# EasyEDA Pro project ProPrj_4足轮足机器蜘蛛_2024-09-02.epro, board 核心板
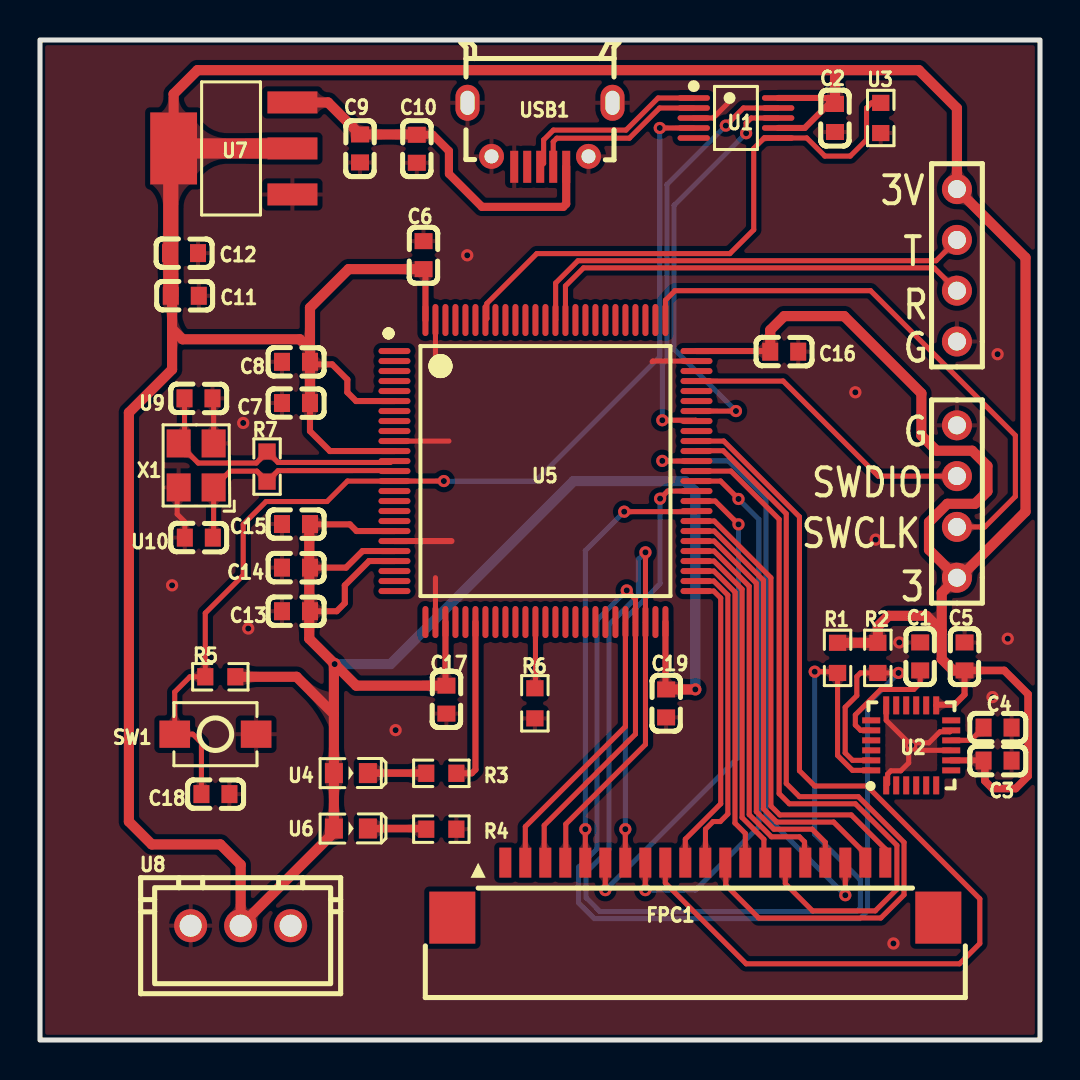
[diagram p4: board, top side]
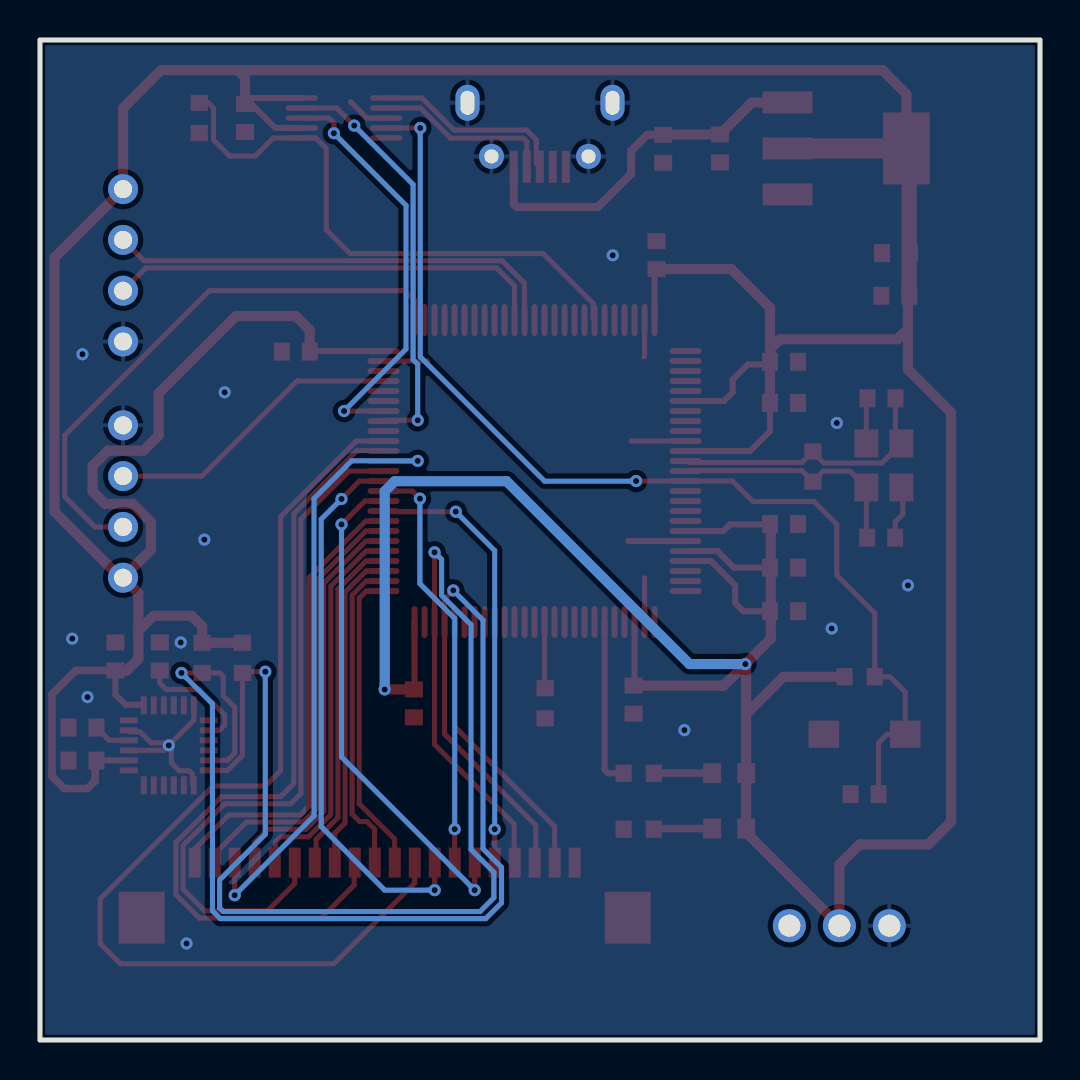
[diagram p5: board, bottom side, seen from below]

Outline 50 x 50 mm; copper layers: Top Layer, Bottom Layer. Coordinates in mm from the lower left corner of the outline.
Outline path: rectangle 0,50 50,0
Stack: Top Layer 0.035mm / Dielectric1 1.51mm FR4 er 4.5 / Bottom Layer 0.035mm

## Design rules (mm)
template: JLCPCB Capability(Two Layers Board)
spacing copperThickness1oz (default): track to track 0.102, other pairs 0.152 to 0.3
spacing copperThickness2oz: track to track 0.203, other pairs 0.152 to 0.3
track width copperThickness1oz (default): min 0.127, default 0.254, max 2.54
track width copperThickness2oz: min 0.203, default 0.254, max 2.54
differential pair differentialPair (default): width min 0.127, default 0.254, max 2.54; gap min 0.152, default 0.152
via viaSize (default): diameter min 0.5, default 0.61, max 10; hole min 0.3, default 0.305, max 6.3

## Placement (name value [footprint] x y rotation side)
C1  2.2nF  [C0603]  44.01 19.18 90 top
C2  100nF  [C0603]  39.75 46.1 90 top
C3  10nF  [C0603]  47.88 13.97 180 top
C4  100nF  [C0603]  47.88 15.62 180 top
C5  100nF  [C0603]  46.23 19.18 90 top
C6  100nF  [C0603]  19.18 39.24 90 top
C7  100nF  [C0603]  12.8 31.85 180 top
C8  100nF  [C0603]  12.8 33.91 180 top
C9  10uF  [C0603]  16 44.58 90 top
C10  100nF  [C0603]  18.84 44.56 270 top
C11  100nF  [C0603]  7.24 37.21 0 top
C12  10uF  [C0603]  7.2 39.34 180 top
C13  100nF  [C0603]  12.8 21.44 180 top
C14  100nF  [C0603]  12.8 23.62 180 top
C15  100nF  [C0603]  12.8 25.8 180 top
C16  100nF  [C0603]  37.21 34.42 0 top
C17  100nF  [C0603]  20.32 17.02 270 top
C18  1uF  [C0603]  8.77 12.3 180 top
C19  100nF  [C0603]  31.31 16.83 270 top
FPC1  1.0K-FX-20PWBG  [FPC-SMD_20P-P1.00-HDGE_1.0K-FX-20PWBG]  32.77 7.49 0 top
R1  10kΩ  [R0603]  39.88 19.11 90 top
R2  10kΩ  [R0603]  41.89 19.11 90 top
R3  1kΩ  [R0603]  20.07 13.33 180 top
R4  1kΩ  [R0603]  20.07 10.54 180 top
R5  10kΩ  [R0603]  9.02 18.16 180 top
R6  10kΩ  [R0603]  24.74 16.83 90 top
R7  1MΩ  [R0603]  11.35 28.67 90 top
SW1  TD-1185SA-2.5H-250  [SW-SMD_L4.0-W2.9-LS5.0]  8.77 15.29 0 top
U1  CH340X  [MSOP-10_L3.0-W3.0-P0.50-LS5.0-BL]  34.8 46.1 270 top
U2  MPU6050_C9900042518  [QFN-24_L4.0-W4.0-P0.50-BL]  43.56 14.73 0 top
U3  4.7kΩ  [R0603]  42.04 46.1 270 top
U4  LED0603B_C9900017731  [LED0603_BLUE]  15.54 13.35 0 top
U5  GD32F470VIT6  [LQFP-100_L14.0-W14.0-P0.50-LS16.0-BL]  25.27 28.45 270 top
U6  LED0603B_C9900017731  [LED0603_BLUE]  15.54 10.57 0 top
U7  AMS1117-3.3  [SOT-223-3_L6.5-W3.4-P2.30-LS7.0-BR]  9.65 44.58 0 top
U8  XH2.54-3P 直插  [CONN-TH_XH2.54-3P]  10.03 5.72 0 top
U9  22pF  [C0603]  7.93 32.08 180 top
U10  22pF  [C0603]  7.94 25.12 0 top
U33  XH2.54MM-4PIN直插式  [XH2.54MM-4PIN]  45.85 42.55 270 top
U34  XH2.54MM-4PIN直插式  [XH2.54MM-4PIN]  45.85 23.11 90 top
USB1  USB-MICRO XNJ JB  [MICRO-USB-SMD_HX-USB-MICRO-XNJ-JB]  25 45.26 180 top
X1  25MHz  [OSC-SMD_4P-L3.2-W2.5-BL]  7.81 28.73 90 top

## Footprints (pads in the part's own frame, mm; a bottom-side part is the same pattern mirrored in y, then rotated)
C0603
  rect 0.8x0.9 smd: 1(-0.7,0) 2(0.7,0)
CONN-TH_XH2.54-3P
  round 1.65 hole 1.1: 1(-2.5,0) 2(0,0) 3(2.5,0)
FPC-SMD_20P-P1.00-HDGE_1.0K-FX-20PWBG
  rect 0.6x1.5 smd: 1(-9.5,1.375) 2(-8.5,1.375) 3(-7.5,1.375) 4(-6.5,1.375) 5(-5.5,1.375) 6(-4.5,1.375) 7(-3.5,1.375) 8(-2.5,1.375) 9(-1.5,1.375) 10(-0.5,1.375) 11(0.5,1.375) 12(1.5,1.375) 13(2.5,1.375) 14(3.5,1.375) 15(4.5,1.375) 16(5.5,1.375) 17(6.5,1.375) 18(7.5,1.375) 19(8.5,1.375) 20(9.5,1.375)
  rect 2.3x2.6 smd: 21(12.15,-1.375) 22(-12.15,-1.375)
LED0603_BLUE
  rect 0.9x1 smd: 1(-0.85,0) 2(0.85,0)
LQFP-100_L14.0-W14.0-P0.50-LS16.0-BL
  oval 0.3x1.6 smd: 1(-6,-7.55) 2(-5.5,-7.55) 3(-5,-7.55) 4(-4.5,-7.55) 5(-4,-7.55) 6(-3.5,-7.55) 7(-3,-7.55) 8(-2.5,-7.55) 9(-2,-7.55) 10(-1.5,-7.55) 11(-1,-7.55) 12(-0.5,-7.55) 13(0,-7.55) 14(0.5,-7.55) 15(1,-7.55) 16(1.5,-7.55) 17(2,-7.55) 18(2.5,-7.55) 19(3,-7.55) 20(3.5,-7.55) 21(4,-7.55) 22(4.5,-7.55) 23(5,-7.55) 24(5.5,-7.55) 25(6,-7.55) 51(6,7.55) 52(5.5,7.55) 53(5,7.55) 54(4.5,7.55) 55(4,7.55) 56(3.5,7.55) 57(3,7.55) 58(2.5,7.55) 59(2,7.55) 60(1.5,7.55) 61(1,7.55) 62(0.5,7.55) 63(0,7.55) 64(-0.5,7.55) 65(-1,7.55) 66(-1.5,7.55) 67(-2,7.55) 68(-2.5,7.55) 69(-3,7.55) 70(-3.5,7.55) 71(-4,7.55) 72(-4.5,7.55) 73(-5,7.55) 74(-5.5,7.55) 75(-6,7.55)
  oval 1.6x0.3 smd: 26(7.55,-6) 27(7.55,-5.5) 28(7.55,-5) 29(7.55,-4.5) 30(7.55,-4) 31(7.55,-3.5) 32(7.55,-3) 33(7.55,-2.5) 34(7.55,-2) 35(7.55,-1.5) 36(7.55,-1) 37(7.55,-0.5) 38(7.55,0) 39(7.55,0.5) 40(7.55,1) 41(7.55,1.5) 42(7.55,2) 43(7.55,2.5) 44(7.55,3) 45(7.55,3.5) 46(7.55,4) 47(7.55,4.5) 48(7.55,5) 49(7.55,5.5) 50(7.55,6) 76(-7.55,6) 77(-7.55,5.5) 78(-7.55,5) 79(-7.55,4.5) 80(-7.55,4) 81(-7.55,3.5) 82(-7.55,3) 83(-7.55,2.5) 84(-7.55,2) 85(-7.55,1.5) 86(-7.55,1) 87(-7.55,0.5) 88(-7.55,0) 89(-7.55,-0.5) 90(-7.55,-1) 91(-7.55,-1.5) 92(-7.55,-2) 93(-7.55,-2.5) 94(-7.55,-3) 95(-7.55,-3.5) 96(-7.55,-4) 97(-7.55,-4.5) 98(-7.55,-5) 99(-7.55,-5.5) 100(-7.55,-6)
MICRO-USB-SMD_HX-USB-MICRO-XNJ-JB
  rect 0.4x1.6 smd: 1(-1.31,1.6) 2(-0.66,1.6) 3(-0.011,1.6) 4(0.639,1.6) 5(1.29,1.6)
  round 1.25 hole 0.7: 6(-2.425,1.08) 7(2.425,1.08)
  oval 1.2x1.8 hole 0.7x1.2: 8(3.625,-1.6) 9(-3.625,-1.6)
MSOP-10_L3.0-W3.0-P0.50-LS5.0-BL
  oval 0.28x1.62 smd: 1(-1,-2.11) 2(-0.5,-2.11) 3(0,-2.11) 4(0.5,-2.11) 5(1,-2.11) 6(1,2.11) 7(0.5,2.11) 8(0,2.11) 9(-0.5,2.11) 10(-1,2.11)
OSC-SMD_4P-L3.2-W2.5-BL
  rect 1.4x1.2 smd: 1(-1.1,-0.875) 2(1.1,-0.875) 3(1.1,0.875) 4(-1.1,0.875)
QFN-24_L4.0-W4.0-P0.50-BL
  rect 0.3x0.9 smd: 1(-1.25,-2) 2(-0.75,-2) 3(-0.25,-2) 4(0.25,-2) 5(0.75,-2) 6(1.25,-2) 13(1.25,2) 14(0.75,2) 15(0.25,2) 16(-0.25,2) 17(-0.75,2) 18(-1.25,2)
  rect 0.9x0.3 smd: 7(2,-1.25) 8(2,-0.75) 9(2,-0.25) 10(2,0.25) 11(2,0.75) 12(2,1.25) 19(-2,1.25) 20(-2,0.75) 21(-2,0.25) 22(-2,-0.25) 23(-2,-0.75) 24(-2,-1.25)
R0603
  rect 0.806x0.864 smd: 1(-0.753,0) 2(0.753,0)
SOT-223-3_L6.5-W3.4-P2.30-LS7.0-BR
  rect 2.5x1.1 smd: 1(2.97,-2.3) 2(2.97,0) 3(2.97,2.3)
  rect 2.34x3.6 smd: 4(-2.97,0)
SW-SMD_L4.0-W2.9-LS5.0
  rect 1.53x1.36 smd: 1(-2.035,0) 2(2.035,0)
XH2.54MM-4PIN
  round 1.5 hole 0.9: 1(0,0) 2(2.54,0) 3(5.08,0) 4(7.62,0)

## Nets
As in the schematic.

Pads without a net: FPC1 1 21 22; U1 5; U2 2 3 4 5 6 7 12 14 15 16 17 19 21 22; U5 1 2 3 4 5 7 8 9 15 16 17 18 23 24 25 26 29 30 32 33 34 35 36 38 39 40 41 42 43 44 45 49 67 70 71 73 77 78 79 80 81 82 83 84 85 88 89 90 91 92 93 95 96 97 98; USB1 4

## Via types
v1: diameter 0.61, hole 0.305, Top Layer to Bottom Layer, 35 vias

## Routing (per net, layer and track width the routed paths; a pad name or vN(x,y) marks a point on that pad's centre or on a via; arc(x,y) is an arc through that point)
3.3V: length 306.1
  Top Layer w0.305: U2.8 47.17,13.98 C3.2 ; U5.100 19.27,38.45 19.18,38.54 ; U5.50 31.27,17.56 C19.1 ; 17.72,25.45 15.83,25.45 15.49,25.78 13.52,25.78 C15.1 ; C16.1 36.48,34.45 U5.75 ; C8.1 13.63,33.78 14.6,33.78 15.37,33.02 15.37,32.39 15.8,31.95 17.72,31.95 ; U2.13 44.84,16.76 45.72,16.76 46.23,17.27 C5.1 ; C14.1 15.3,23.62 16.13,24.45 17.72,24.45 ; 17.72,29.45 14.49,29.45 13.5,30.44 C7.1 ; C17.1 20.27,17.77 U5.28 ; U1.7 38.24,45.6 39.44,46.8 C2.2 39.45,47.1 U1.10 ; C13.1 14.84,21.44 15.24,21.84 15.24,22.73 16.46,23.95 17.72,23.95
  Top Layer w0.381: C5.1 48.21,18.48 49.4,17.29 49.4,13.19 48.78,12.57 47.62,12.57 47.24,12.95 47.24,13.91 C3.2
  Top Layer w0.508: U34.1 45.09,22.35 45.09,20.45 ; U34.1 45.97,23.11 49.28,26.42 49.28,39.12 U33.1 45.85,46.59 43.94,48.49 40.11,48.49 ; U34.1 44.45,24.51 44.45,25.89 45.37,26.81 46.75,26.81 47.37,27.43 47.37,28.7 46.61,29.46 44.83,29.46 44.07,30.23 44.07,32.33 40.21,36.19 37.21,36.19 36.51,35.5 C16.1 ; 40.11,48.49 39.75,48.13 C2.2 ; 40.11,48.49 7.87,48.49 6.68,47.3 U7.4 ; C15.1 13.46,25.76 13.46,20.07 14.69,18.83 ; 45.09,20.45 44.32,21.21 42.42,21.21 41.89,20.68 R2.2 R1.2 ; 45.09,20.45 45.09,19.05 45.66,18.48 C5.1 ; C17.1 15.81,17.72 14.69,18.83 ; C7.1 C8.1 13.5,34.53 ; 6.6,35.56 6.6,37.15 C11.1 ; 6.6,35.56 7.13,35.04 12.99,35.04 13.5,34.53 ; 6.6,35.56 6.6,33.53 4.44,31.37 4.44,10.92 5.59,9.78 9.02,9.78 10.03,8.76 U8.2 14.69,10.38 U6.1 U4.1 14.69,16.29 ; 13.5,34.53 13.5,36.61 15.43,38.54 19.18,38.54 ; 14.69,18.83 14.69,16.29 ; C19.1 v1(32.77,17.53) ; R5.1 12.83,18.16 14.69,16.29
  Top Layer w0.762: U7.4 6.54,44.43 C11.1
  Top Layer w1.016: U7.2 U7.4
  Bottom Layer w0.508: v1(32.77,17.53) 32.77,27.43 32.26,27.94 26.67,27.94 17.53,18.8 v1(14.73,18.8)
GND: length 28.6
  Top Layer w0.254: 34.48,46.93 33.66,46.1 U1.3 ; 19.81,34.16 19.77,34.2 U5.99 ; U2.1 42.38,12.8 42.38,13.3 42.55,13.46 43.04,13.46 43.43,13.86 43.43,14.86 ; 43.43,14.86 44.44,14.86 45,15.41 45.49,15.41 U2.11 ; 43.43,14.86 42.31,15.98 U2.18 ; U2.9 43.81,14.48 v1(43.56,14.73) ; U5.27 19.77,23.11 ; 30.61,33.91 30.65,33.95 U5.74 ; U10.1 7.24,25.91 6.86,26.29 6.86,27.55 X1.4 ; 17.72,29.95 20.45,29.95 ; X1.2 8.68,32.03
  Top Layer w0.305: 17.72,24.95 20.57,24.95
  vias: v1(6.6,22.73) v1(10.16,30.85) v1(10.41,20.57) v1(17.78,15.49) v1(21.36,39.24) v1(40.77,32.39) v1(41.78,25.02) v1(42.67,4.83) v1(42.96,19.88) v1(47.62,17.14) v1(47.88,34.29) v1(48.39,20.07)
VBUS: length 18.4
  Top Layer w0.406: C10.1 19.64,45.26 20.45,44.45 20.45,43.31 22.1,41.66 26.16,41.66 26.31,41.8 USB1.1
  Top Layer w0.508: C10.1 18.82,45.28 C9.2 14.4,46.88 U7.3
BOOT0: length 28.8
  Top Layer w0.254: U3.1 41.58,46.85 41.33,46.6 41.33,45.01 40.51,44.2 39.24,44.2 38.34,45.1 U1.6 36.21,45.1 35.69,44.58 35.69,40.51 34.49,39.32 24.84,39.32 22.34,36.83 22.34,36.07 U5.94
BOOT1: length 3.3
  Top Layer w0.254: U5.37 24.77,17.62 R6.2
D+: length 9.8
  Top Layer w0.254: USB1.3 25.18,43.83 25.18,45.01 25.67,45.5 29.3,45.5 30.91,47.1 U1.1
D-: length 9
  Top Layer w0.254: USB1.2 25.66,44.91 25.84,45.09 29.47,45.09 30.98,46.6 U1.2
I2C1_SCL: length 67.5
  Top Layer w0.254: v1(29.34,22.48) 29.77,22.04 U5.47 29.77,15.3 25.21,10.73 25.21,8.92 FPC1.3 ; v1(42.93,18.35) R2.1 41.02,18.35 40.84,18.17 40.84,17.22 40.26,16.64 40.26,14.35 40.63,13.98 U2.23
  Bottom Layer w0.254: v1(42.93,18.35) 41.38,16.8 41.38,6.46 40.99,6.07 27.71,6.07 26.92,6.86 26.92,8.64 27.85,9.56 27.85,20.99 v1(29.34,22.48)
I2C1_SDA: length 69.8
  Top Layer w0.254: v1(30.27,24.38) U5.48 30.27,14.78 26.29,10.8 26.29,8.89 FPC1.4 ; v1(38.74,18.42) 39.82,18.42 R1.1 39.88,14.23 40.62,13.48 U2.24
  Bottom Layer w0.254: v1(38.74,18.42) 38.74,10.29 41.02,8 41.02,6.6 40.84,6.42 27.99,6.42 27.31,7.11 27.31,8.38 28.45,9.53 28.45,20.76 29.92,22.24 29.92,24.03 v1(30.27,24.38)
LEFT1_AIN1: length 20.4
  Top Layer w0.254: FPC1.17 39.27,9.88 38.61,10.54 36.69,10.54 35.82,11.42 35.82,22.84 33.7,24.95 U5.56
LEFT1_AIN2: length 19.2
  Top Layer w0.254: U5.55 33.7,24.45 35.46,22.69 35.46,11.27 36.57,10.16 37.97,10.16 38.23,9.91 38.23,8.91 FPC1.16
LEFT1_IN: length 27.6
  Top Layer w0.254: U5.62 34.03,27.95 v1(34.93,27.05) ; FPC1.8 v1(30.27,7.49)
  Bottom Layer w0.254: v1(30.27,7.49) 32.77,7.49 35.94,10.67 35.94,26.03 v1(34.93,27.05)
LEFT1_PWM: length 35.6
  Top Layer w0.254: FPC1.15 37.27,7.82 38.63,6.46 41.76,6.46 42.84,7.54 42.84,9.73 40.77,11.81 37.47,11.81 36.96,12.32 36.96,26.03 34.54,28.45 U5.63
LEFT2_BIN1: length 23.6
  Top Layer w0.254: FPC1.20 42.27,9.55 40.56,11.25 36.99,11.25 36.54,11.7 36.54,23.11 33.71,25.95 U5.58
LEFT2_BIN2: length 22.3
  Top Layer w0.254: FPC1.19 41.27,9.31 39.68,10.9 36.84,10.9 36.17,11.57 36.17,22.98 33.71,25.45 U5.57
LEFT2_IN: length 20.9
  Top Layer w0.254: v1(31,27.07) 31.38,27.45 U5.61 ; FPC1.7 v1(29.27,10.54)
  Bottom Layer w0.254: v1(31,27.07) 31,22.82 29.27,21.08 v1(29.27,10.54)
LEFT2_PWM: length 30.8
  Top Layer w0.254: U5.64 31.12,28.95 v1(31.12,28.96) ; FPC1.18 v1(40.27,7.24)
  Bottom Layer w0.254: v1(40.27,7.24) 36.3,11.21 36.3,27.08 34.42,28.96 v1(31.12,28.96)
PAC9685_OE: length 14.1
  Top Layer w0.254: FPC1.2 24.27,10.67 29.27,15.67 U5.46
RESET: length 53.9
  Top Layer w0.254: v1(20.19,27.95) 15.38,27.95 14.35,26.92 11.3,26.92 10.16,25.78 10.16,23.24 8.26,21.34 R5.2 7.5,18.16 6.74,17.4 SW1.1 7.64,15.29 8.07,14.86 C18.2 ; U1.4 v1(30.99,45.6)
  Bottom Layer w0.254: v1(20.19,27.95) 20.2,27.94 24.76,27.94 30.99,34.16 v1(30.99,45.6)
RIGHT1_AIN1: length 17
  Top Layer w0.254: U5.54 33.7,23.95 35.1,22.54 35.1,11.12 36.19,10.03 36.19,8.94 FPC1.14
RIGHT1_AIN2: length 16.1
  Top Layer w0.254: FPC1.13 35.27,10.33 34.75,10.84 34.75,22.39 33.69,23.45 U5.53
RIGHT1_IN: length 25
  Top Layer w0.254: U5.60 33.76,26.95 v1(34.93,25.78) ; FPC1.6 v1(28.27,7.49)
  Bottom Layer w0.254: v1(34.93,25.78) 34.93,14.15 v1(28.27,7.49)
RIGHT1_PWM: length 40.2
  Top Layer w0.254: U5.65 32.84,29.46 34.16,29.46 37.31,26.31 37.31,12.83 37.97,12.17 40.91,12.17 43.2,9.88 43.2,7.26 42.04,6.1 35.94,6.1 34.29,7.75 34.29,8.84 FPC1.12
RIGHT2_BIN1: length 15.9
  Top Layer w0.254: U5.52 33.69,22.95 34.39,22.25 34.39,11.3 34.01,10.92 33.66,10.92 33.27,10.54 33.27,8.88 FPC1.11
RIGHT2_BIN2: length 15.3
  Top Layer w0.254: FPC1.10 32.27,10.04 34.04,11.81 34.04,22.1 33.69,22.45 U5.51
RIGHT2_IN: length 22
  Top Layer w0.254: v1(29.21,26.42) 32.79,26.42 U5.59 ; FPC1.5 v1(27.27,10.54)
  Bottom Layer w0.254: v1(29.21,26.42) 27.27,24.47 v1(27.27,10.54)
RIGHT2_PWM: length 52.2
  Top Layer w0.254: U5.66 34.19,29.95 37.97,26.16 37.97,13.46 38.74,12.7 41.35,12.7 46.99,7.06 46.99,4.83 45.97,3.81 35.31,3.81 31.27,7.85 FPC1.9
SWCLK: length 28.3
  Top Layer w0.254: U34.2 47.24,25.65 48.77,27.18 48.77,30.23 41.53,37.47 31.75,37.47 31.27,36.99 U5.76
SWDIO: length 15
  Top Layer w0.254: U5.72 37.16,32.95 41.91,28.19 U34.3
TEST_LED: length 8.4
  Top Layer w0.305: U5.31 21.77,13.52 21.59,13.33 R3.1
UART1_RX: length 22.8
  Top Layer w0.254: U5.87 25.78,36.01 25.78,37.85 26.9,38.96 44.81,38.96 U33.2
UART1_TX: length 22.1
  Top Layer w0.254: U33.3 44.7,38.61 27.18,38.61 26.27,37.7 U5.86
URAT0_RX: length 20.9
  Top Layer w0.254: U5.69 v1(34.8,31.45) ; U1.8 35.56,46.1 35.31,45.85 v1(35.31,45.34)
  Bottom Layer w0.254: v1(35.31,45.34) 31.7,41.73 31.7,34.55 v1(34.8,31.45)
URAT0_TX: length 20.8
  Top Layer w0.254: v1(34.29,45.72) 35.17,46.6 U1.9 ; v1(31.12,30.99) 32.78,30.99 U5.68
  Bottom Layer w0.254: v1(31.12,30.99) 31.12,33.79 31.34,34.02 31.34,42.77 v1(34.29,45.72)
XI: length 13.9
  Top Layer w0.254: 17.53,28.88 11.9,28.88 R7.2 11.35,29.39 10.81,28.85 7.91,28.85 X1.3 7.23,30.12 U9.2
XO: length 12.2
  Top Layer w0.254: U10.2 8.68,25.16 X1.1 9.5,28.44 10.85,28.44 11.35,27.94 R7.1 11.9,28.47 17.53,28.47
$1N2326: length 3
  Top Layer w0.381: 19.31,13.22 19.18,13.35 U4.2
$1N2866: length 5.9
  Top Layer w0.254: C1.1 44.01,17.85 43.69,17.53 42.04,17.53 40.77,16.26 40.77,15.75 41.03,15.48 U2.20
$1N2867: length 1.9
  Top Layer w0.254: C4.2 46.54,14.98 U2.10
$1N2956: length 3
  Top Layer w0.381: 19.31,10.67 19.22,10.57 U6.2

## Copper pours and planes (outline as drawn; the poured copper is in the pictures)
GND on Top Layer: 50.55,0 50.55,50.55 -0.76,50.55 -0.76,0.13 -0.89,0
GND on Bottom Layer: -2.03,50.93 52.32,50.93 53.97,49.28 53.97,-3.81 -4.06,-3.81 -4.95,-2.92 -4.95,48.01

Small or netless copper shapes (teardrops, artwork), in the pictures only: 159 on Top Layer, 20 on Bottom Layer

## Text on the board
Top Silkscreen Layer: SWCLK | SWDIO | 3V | 3 | T | R | G
